# Altium schematic sheet PowerModule.SchDoc
size A
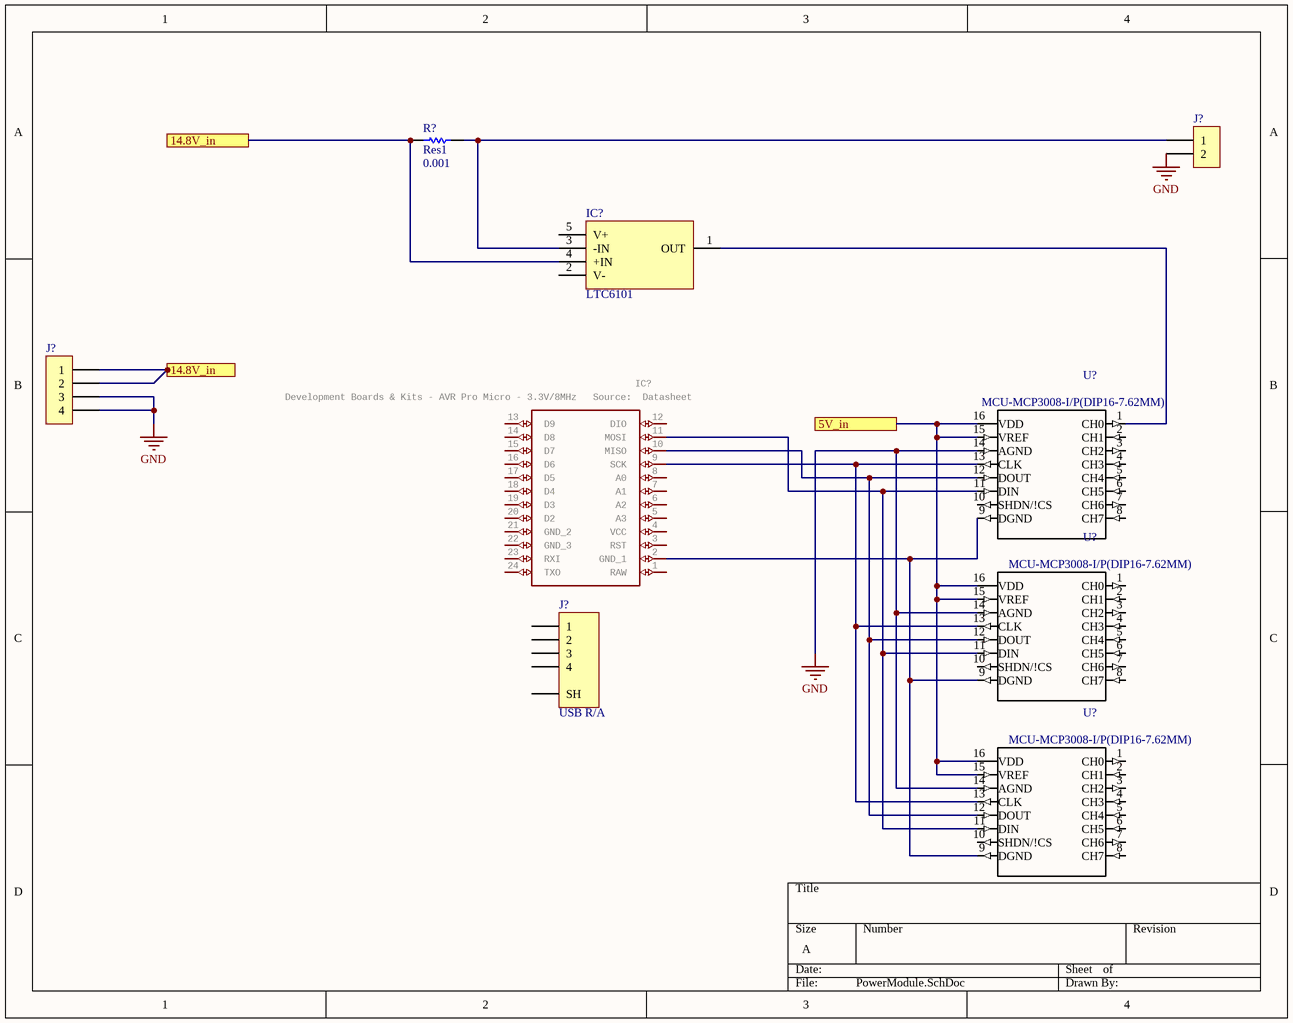
[diagram p0: PowerModule.SchDoc]

## Parts
(Parts that share a designator on the sheet are numbered #1, #2 ... from top to bottom, then left to right.)
IC?#1  LTC6101  [SOT23_5]
IC?#2  Development Boards & Kits - AVR Pro Micro - 3.3V/8MHz   Source:  Datasheet  [DEV12587]
J?#1  CON2  [CON2DEUTSCHRA]  (value not drawn)
J?#2  CON4  [CON4DEUTSCHRA]  (value not drawn)
J?#3  value USB R/A  [CON4USBSMTHOST]  (hidden comment: CON4USBSMTHOST)
R?  Res1  value 0.001  [AXIAL-0.3]
U?#1  MCU-MCP3008-I/P(DIP16-7.62MM)  [*DIP16-2.54-19.2X7.62MM]
U?#2  MCU-MCP3008-I/P(DIP16-7.62MM)  [*DIP16-2.54-19.2X7.62MM]
U?#3  MCU-MCP3008-I/P(DIP16-7.62MM)  [*DIP16-2.54-19.2X7.62MM]

## Ports
5V_in, 14.8V_in

## Nets
GND: J?#1.2 J?#2.3 J?#2.4 U?#1.14(AGND) U?#2.14(AGND) U?#3.14(AGND)
5V_in: U?#1.15(VREF) U?#1.16(VDD) U?#2.15(VREF) U?#2.16(VDD) U?#3.15(VREF) U?#3.16(VDD) ; port 5V_in
14.8V_in: IC?#1.4(+IN) J?#2.1 J?#2.2 R?.1 ; port 14.8V_in
NetIC?#1_1: IC?#1.1(OUT) U?#1.1(CH0)
NetIC?#1_3: IC?#1.3(-IN) J?#1.1 R?.2
NetIC?#2_2: IC?#2.2(GND_1) U?#1.9(DGND) U?#2.9(DGND) U?#3.9(DGND)
NetIC?#2_9: IC?#2.9(SCK) U?#1.13(CLK) U?#2.13(CLK) U?#3.13(CLK)
NetIC?#2_10: IC?#2.10(MISO) U?#1.12(DOUT) U?#2.12(DOUT) U?#3.12(DOUT)
NetIC?#2_11: IC?#2.11(MOSI) U?#1.11(DIN) U?#2.11(DIN) U?#3.11(DIN)

Not connected (* = marked no-connect by the designer): IC?#1 2(V-) 5(V+); IC?#2 1(RAW) 3(RST) 4(VCC) 5(A3) 6(A2) 7(A1) 8(A0) 12(DIO) 13(D9) 14(D8) 15(D7) 16(D6) 17(D5) 18(D4) 19(D3) 20(D2) 21(GND_2) 22(GND_3) 23(RXI) 24(TXO); J?#3 1 2 3 4 SH; U?#1 2(CH1) 3(CH2) 4(CH3) 5(CH4) 6(CH5) 7(CH6) 8(CH7) 10(SHDN/!CS); U?#2 1(CH0) 2(CH1) 3(CH2) 4(CH3) 5(CH4) 6(CH5) 7(CH6) 8(CH7) 10(SHDN/!CS); U?#3 1(CH0) 2(CH1) 3(CH2) 4(CH3) 5(CH4) 6(CH5) 7(CH6) 8(CH7) 10(SHDN/!CS)

## Library data of the parts
IC?#1 = 5461120459: AS400 PART NO: 15461120459; MFR: LINEAR; MFR_PART_NO: LTC6101AIS5#TRMPBF; Released: Y; OnHandQty: 598; 12MoUse: 2,582; PART NUMBER: 5461120459; Rel/Rev Date: 5/19/14; Cost: 1.7300
IC?#2 = DEV-12587: Manufacturer_Name: SparkFun; GateName_1: G$1; SymbolName_1: DEV-12587; LibraryName: DEV-12587; DeviceSetName: DEV-12587; Package: DEV12587; Manufacturer_Part_Number: DEV-12587; Mouser_Part_Number: 474-DEV-12587; Mouser_Price-Stock: https://www.mouser.com/Search/Refine.aspx?Keyword=474-DEV-12587; Height: 3mm
J?#1 = 4050300334: Connector; AS400 PART NO: 14050300334; MFR: TE; MFR_PART_NO: DTF13-2P; Released: Y; OnHandQty: 51; 12MoUse: 0; PART NUMBER: 4050300334; Cost: 3.0200
J?#2 = 4050300335: AS400 PART NO: 14050300335; MFR: TE; MFR_PART_NO: DTF13-4P; Released: Y; OnHandQty: 98; 12MoUse: 0; PART NUMBER: 4050300335; Cost: 3.2300
J?#3 = 4050300323: Connector; AS400 PART NO: 14050300323; MFR: FCI; MFR_PART_NO: 87583-2010BLF; Released: Y; OnHandQty: 1; 12MoUse: 3,150; PART NUMBER: 4050300323; Cost: 0.3399
R? = Res1: Resistor; Published: 8-Jun-2000; LatestRevisionDate: 17-Jul-2002; LatestRevisionNote: Re-released for DXP Platform.; PackageReference: AXIAL-0.3; Publisher: Altium Limited; PackageDescription: Axial Device, Thru-Hole; 2 Leads; 0.3 in Pin Spacing
U?#1-U?#3 = MCU-MCP3008-I/P(DIP16-7.62MM): 10 Bit Analog to Digital Converter 4, 8 Input 1 SAR 16-PDIP; MF: Microchip; SnapEDA_Link: https://www.snapeda.com/parts/MCP3008-I/P/Microchip/view-part/43628/?ref=snap; Availability: Unavailable; MP: MCP3008-I/P; Price: None; Package: DIP-16 Microchip; Value: *